# Altium schematic sheet 2 Analog.SchDoc
size A
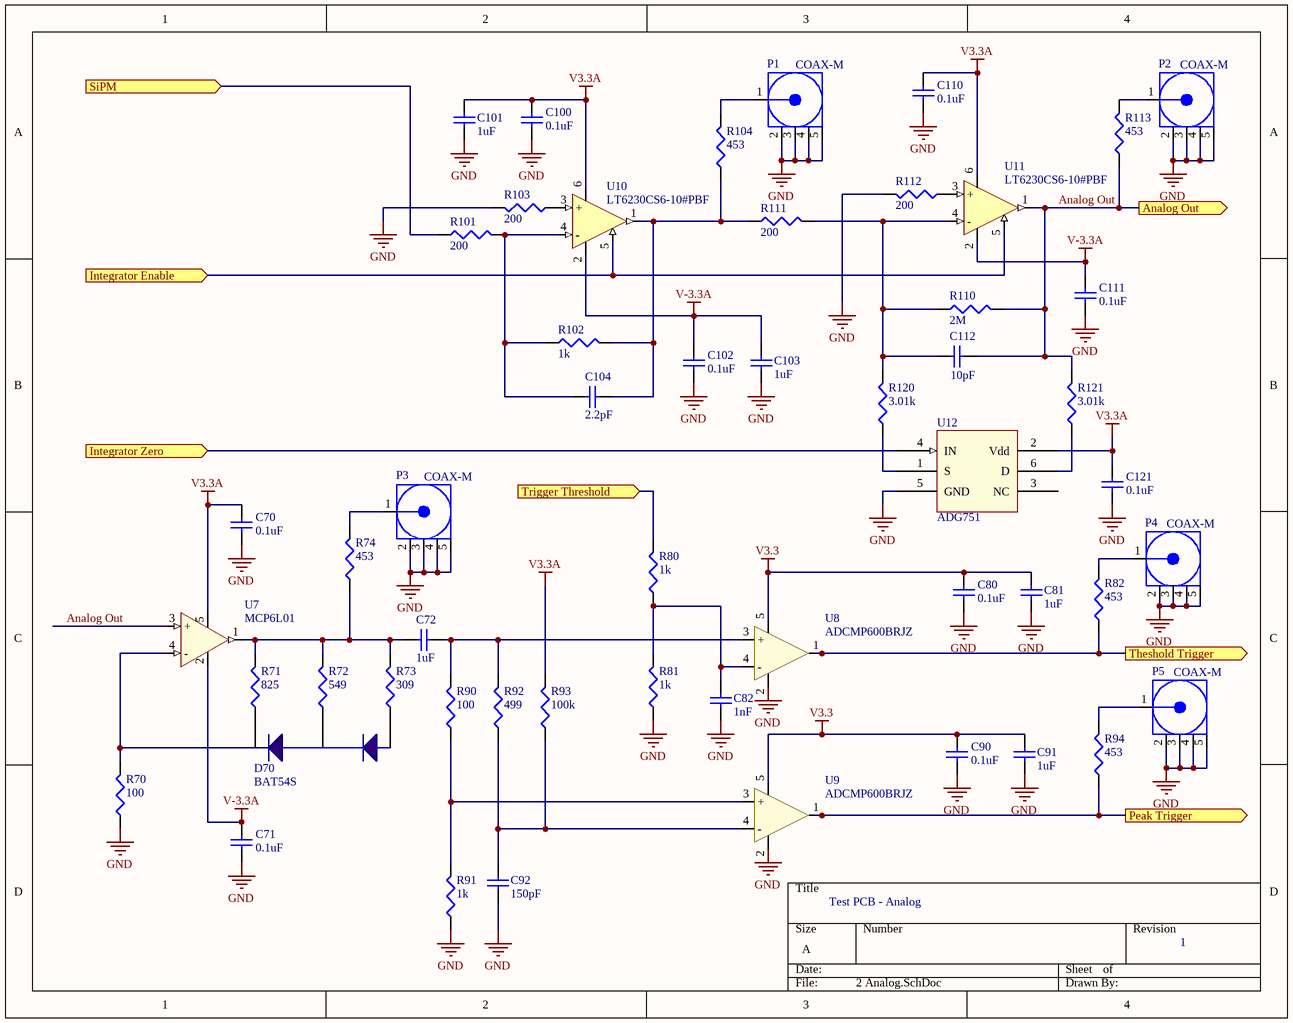
[diagram p0: 2 Analog.SchDoc]

## Parts
C70  0.1uF  [C0402]
C71  0.1uF  [C0402]
C72  1uF  [C0603]
C80  0.1uF  [C0402]
C81  1uF  [C0603]
C82  1nF  [C0603]
C90  0.1uF  [C0402]
C91  1uF  [C0603]
C92  150pF  [C0603]
C100  0.1uF  [C0402]
C101  1uF  [C0603]
C102  0.1uF  [C0402]
C103  1uF  [C0603]
C104  2.2pF  [C0603]
C110  0.1uF  [C0402]
C111  0.1uF  [C0402]
C112  10pF  [C0603]
C121  0.1uF  [C0402]
D70  BAT54S  [SOT323-3]
P1  COAX-M  [MMCX/SM]
P2  COAX-M  [MMCX/SM]
P3  COAX-M  [MMCX/SM]
P4  COAX-M  [MMCX/SM]
P5  COAX-M  [MMCX/SM]
R70  100  [R0603]
R71  825  [R0603]
R72  549  [R0603]
R73  309  [R0603]
R74  453  [R0603]
R80  1k  [R0603]
R81  1k  [R0603]
R82  453  [R0603]
R90  100  [R0603]
R91  1k  [R0603]
R92  499  [R0603]
R93  100k  [R0603]
R94  453  [R0603]
R101  200  [R0603]
R102  1k  [R0603]
R103  200  [R0603]
R104  453  [R0603]
R110  2M  [R0603]
R111  200  [R0603]
R112  200  [R0603]
R113  453  [R0603]
R120  3.01k  [R0603]
R121  3.01k  [R0603]
U7  MCP6L01  [SOT23-5]
U8  ADCMP600BRJZ  [SC70-5]
U9  ADCMP600BRJZ  [SC70-5]
U10  LT6230CS6-10#PBF  [SOT23-6]
U11  LT6230CS6-10#PBF  [SOT23-6]
U12  ADG751  [SOT23-6]

## Ports
Analog Out (out), Integrator Enable (in), Integrator Zero (in), Peak Trigger (out), SiPM (in), Theshold Trigger (out), Trigger Threshold (in)

## Nets
GND: C70.1 C71.1 C80.1 C81.1 C82.1 C90.1 C91.1 C92.1 C100.1 C101.1 C102.1 C103.1 C110.1 C111.1 C121.1 P1.2(GND) P1.3(GND) P1.4(GND) P1.5(GND) P2.2(GND) P2.3(GND) P2.4(GND) P2.5(GND) P3.2(GND) P3.3(GND) P3.4(GND) P3.5(GND) P4.2(GND) P4.3(GND) P4.4(GND) P4.5(GND) P5.2(GND) P5.3(GND) P5.4(GND) P5.5(GND) R70.1 R81.1 R91.1 R103.2 R112.2 U8.2(GND) U9.2(GND) U12.5(GND)
V3.3: C80.2 C81.2 C90.2 C91.2 U8.5(Vcc) U9.5(Vcc)
V3.3A: C70.2 C100.2 C101.2 C110.2 C121.2 R93.2 U7.5(Vdd) U10.6(V+) U11.6(V+) U12.2(Vdd)
V-3.3A: C71.2 C102.2 C103.2 C111.2 U7.2(GND) U10.2(V-) U11.2(V-)
Analog Out: C112.2 R110.2 R113.1 R121.2 U7.3(+) U11.1(Output) ; port Analog Out
Integrator Enable: U10.5(/S/D) U11.5(/S/D) ; port Integrator Enable
Integrator Zero: U12.4(IN) ; port Integrator Zero
Peak Trigger: R94.1 U9.1(Q) ; port Peak Trigger
SiPM: R101.1 ; port SiPM
Theshold Trigger: R82.1 U8.1(Q) ; port Theshold Trigger
Trigger Threshold: R80.2 ; port Trigger Threshold
NetC72_1: C72.1 R90.2 R92.2 U8.3(+)
NetC72_2: C72.2 R71.2 R72.2 R73.2 R74.1 U7.1(Vout)
NetC82_2: C82.2 R80.1 R81.2 U8.4(-)
NetC92_2: C92.2 R92.1 R93.1 U9.4(-)
NetC104_1: C104.1 R101.2 R102.1 U10.4(-)
NetC104_2: C104.2 R102.2 R104.1 R111.1 U10.1(Output)
NetC112_1: C112.1 R110.1 R111.2 R120.2 U11.4(-)
NetD70_1: D70.1 R73.1
NetD70_2: D70.2 R71.1
NetD70_3: D70.3 R72.1
NetP1_1: P1.1(Signal) R104.2
NetP2_1: P2.1(Signal) R113.2
NetP3_1: P3.1(Signal) R74.2
NetP4_1: P4.1(Signal) R82.2
NetP5_1: P5.1(Signal) R94.2
NetR70_2: R70.2 U7.4(-)
NetR90_1: R90.1 R91.2 U9.3(+)
NetR103_1: R103.1 U10.3(+)
NetR112_1: R112.1 U11.3(+)
NetR120_1: R120.1 U12.1(S)
NetR121_1: R121.1 U12.6(D)

Not connected (* = marked no-connect by the designer): U12 3(NC)

## Notes on the sheet
- Test PCB - Analog
- 1

## Library data of the parts
C70-C72 C80-C82 C90-C92 C100-C104 C110-C112 C121 = Cap SM: Capacitor, SM; Published: 8-Jun-2000; LatestRevisionDate: 29-May-2009; LatestRevisionNote: IPC-7351 Footprint Added.; PackageReference: C1206; Publisher: Altium Limited; PackageDescription: Chip Capacitor
  C70 C71 C80 C90 C100 C102 C110 C111 C121: Value: 0.1uF
  C72 C81 C91 C101 C103: Value: 1uF
  C82: Value: 1nF
  C92: Value: 150pF
  C104: Value: 2.2pF
  C112: Value: 10pF
P1-P5 = COAX-M: RF Coaxial PCB Connector, MMCX; Thru-Hole, Vertical Mount Plug,  50 Ohm Impedance; PackageDocument: Rev. A, 16-Jun-1997; PCB_Layout: Complies with manufacturer's recommendation.; DrillSize: Corresponds to nominal value.; Published: 15-Jul-2004; LatestRevisionDate: 15-Jul-2004; LatestRevisionNote: Component Replaced.; DatasheetDocument: 30-May-2003; PackageReference: 908-21103; Publisher: Altium Limited; ComponentLink1Description: Manufacturer Link; ComponentLink1URL: http://www.amphenolrf.com/
R70-R74 R80-R82 R90-R94 R101-R104 R110-R113 R120 R121 = Res SM: Resistor; Published: 8-Jun-2000; LatestRevisionDate: 29-May-2009; LatestRevisionNote: IPC-7351 Footprint Added.; PackageReference: J1-0603; Publisher: Altium Limited; PackageDescription: Chip Resistor
  R70 R90: Value: 100
  R71: Value: 825
  R72: Value: 549
  R73: Value: 309
  R74 R82 R94 R104 R113: Value: 453
  R80 R81 R91 R102: Value: 1k
  R92: Value: 499
  R93: Value: 100k
  R101 R103 R111 R112: Value: 200
  R110: Value: 2M
  R120 R121: Value: 3.01k
U7 = MCP6L01: Op amp RRIO
U8 U9 = ADCMP600: Comparator
U10 U11 = LMH6639: Op amp, RRO